# Altium schematic sheet 03-BLOCK DIAGRAM_CP BOARD.SchDoc
size 513 x 386 mm
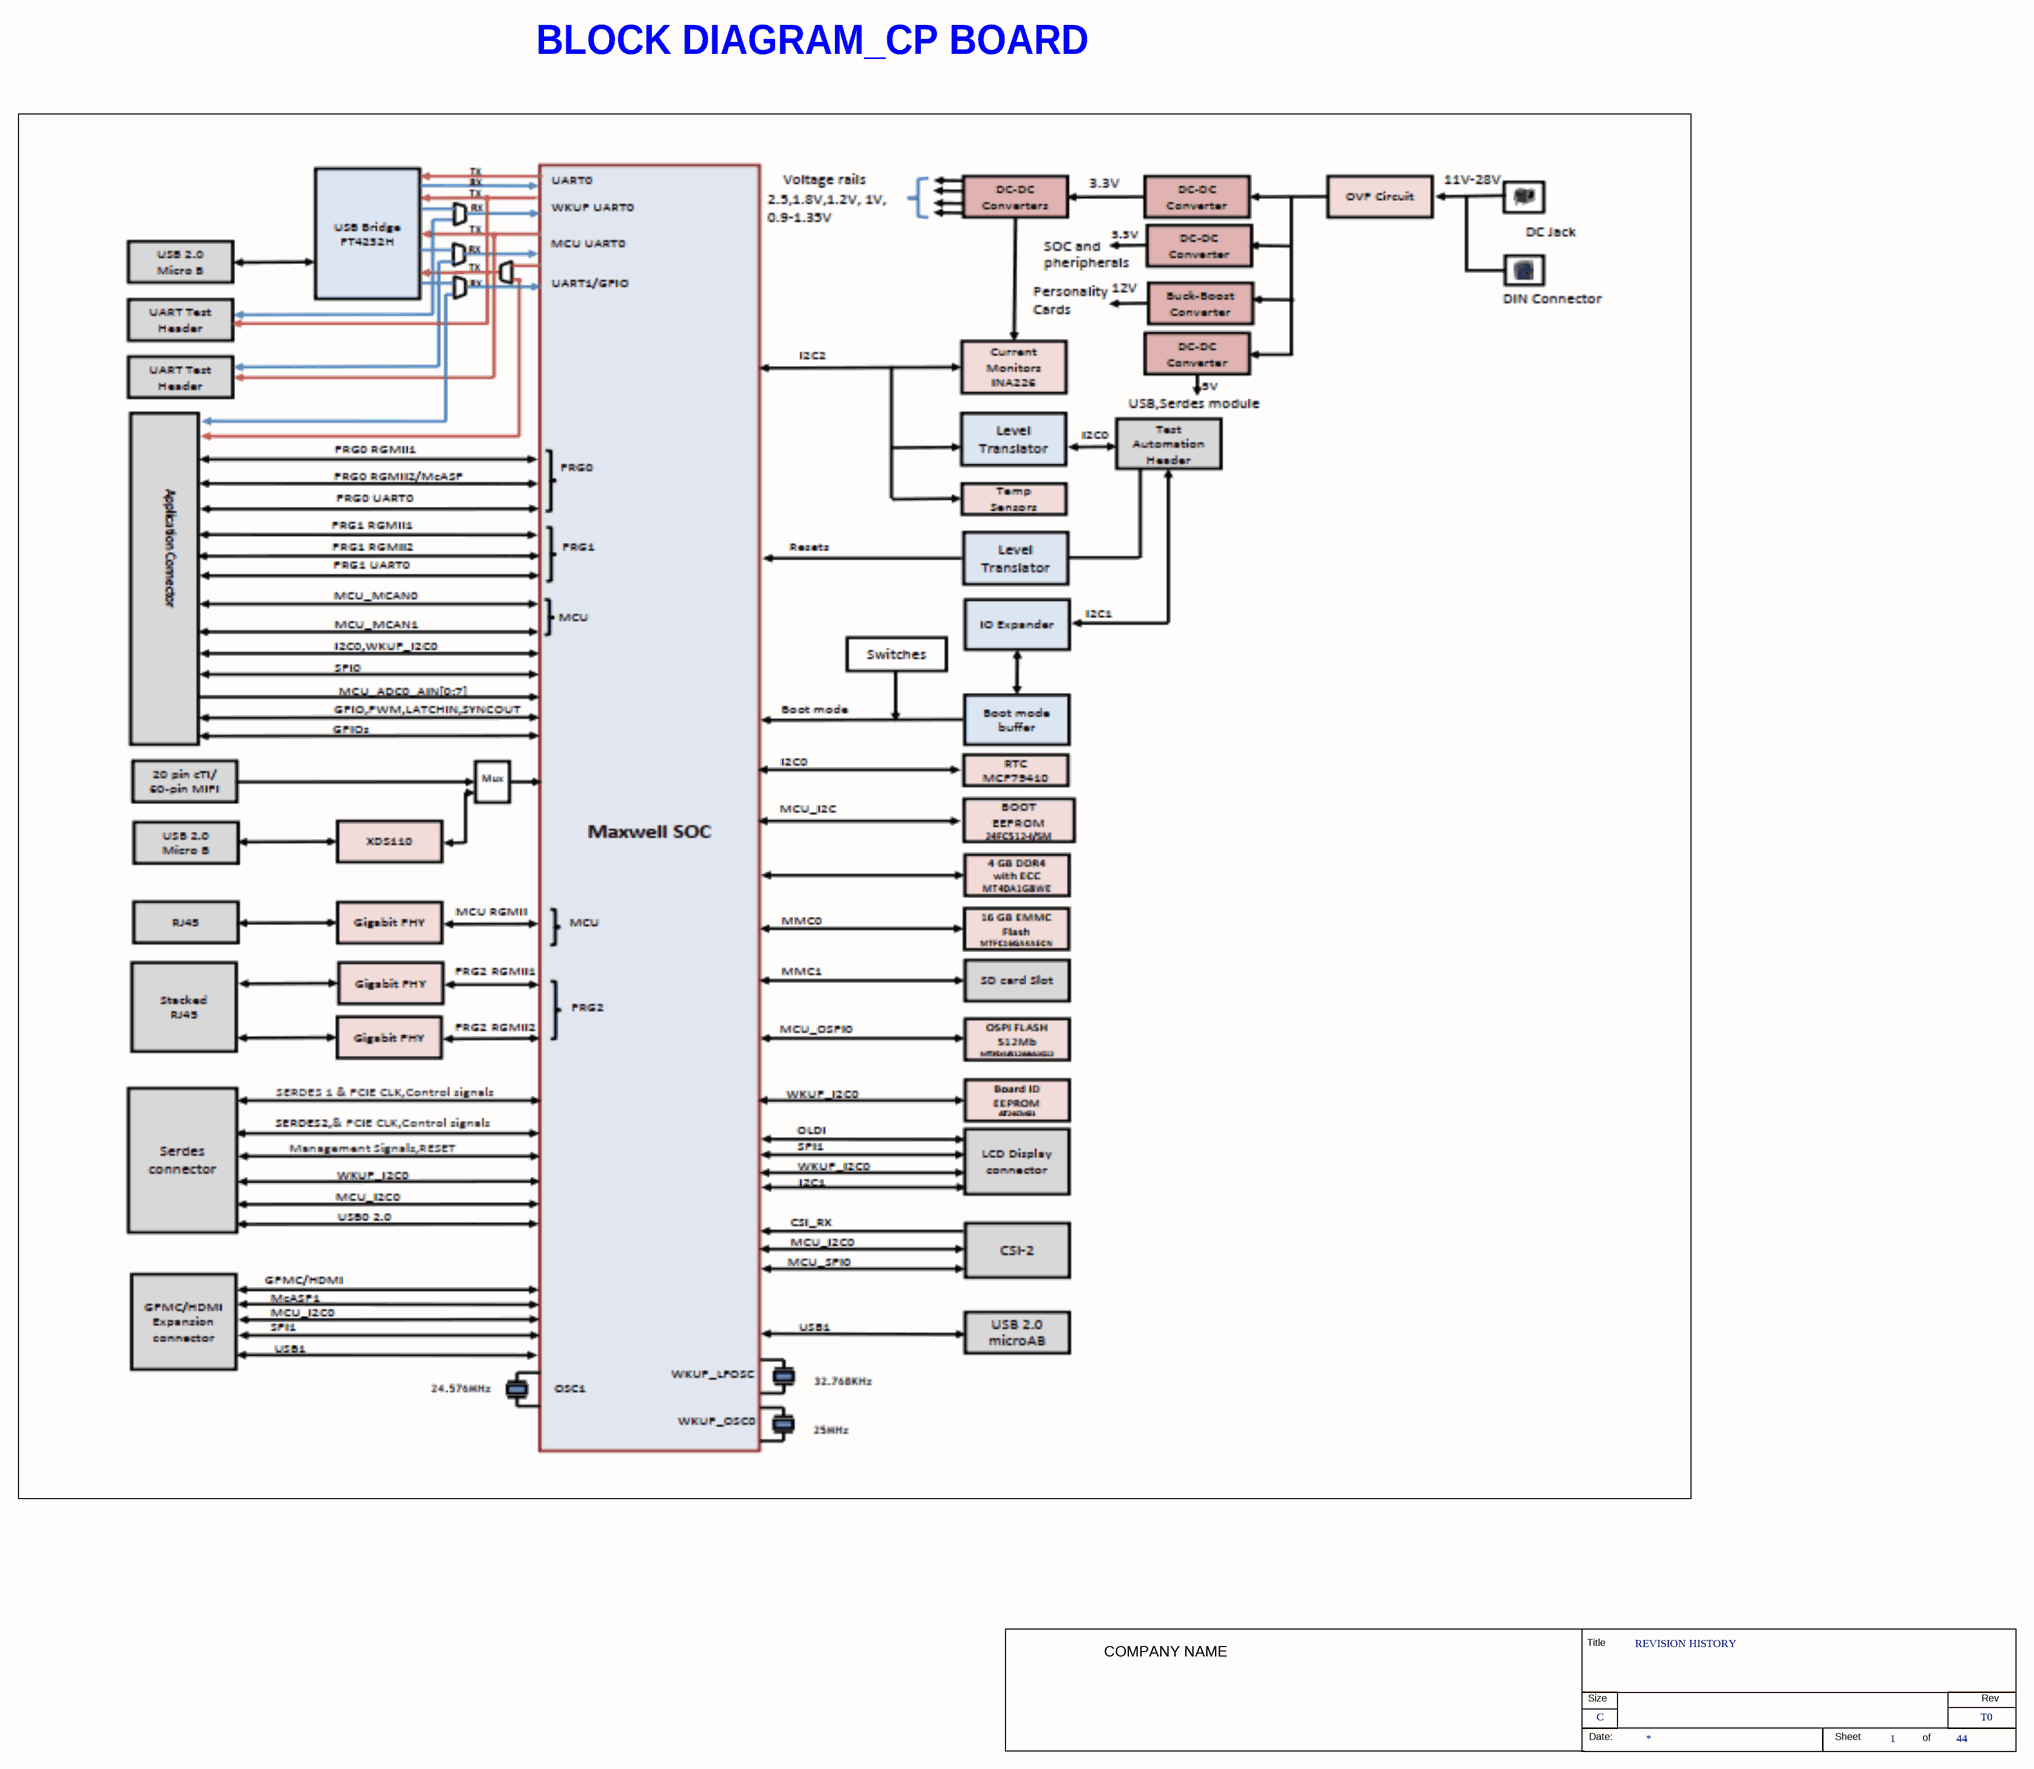
[diagram p0: 03-BLOCK DIAGRAM_CP BOARD.SchDoc]

## Parts
*  RevCode: T0  Title: REVISION HISTORY  Page Size: C  Page Number: 1  Page Count: 44  (hidden comment: TRAINING_TITLEBLK_CSIZE)  (graphical)

## Notes on the sheet
- BLOCK DIAGRAM_CP BOARD
- (in symbol TRAINING_TITLEBLK_CSIZE) Title; COMPANY NAME; Size; Rev; Date:; Sheet; of

## Library data of the parts
* = TRAINING_TITLEBLK_CSIZE: Issue: 1.0; Page Create Date: Jan  8, 2022; Page Modify Date: *